# Altium project QUTMS-RAD-COMPILE-V00.PrjPcb
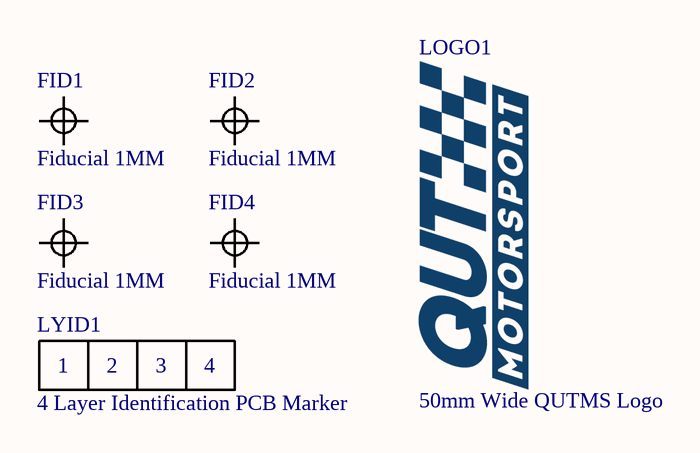
[diagram p0: RAD-Manufacturing-S00-V00.SchDoc]
1 sheet, 6 parts. Net scope: global (net labels, ports and power ports of the same name join across sheets).
Board file: RAD-B00-V00.PcbDoc

## Sheet RAD-Manufacturing-S00-V00.SchDoc: Manufacturing Items / Logos
size A4; Author: Jonn Dillon; DrawnBy: Jonn Dillon; SheetNumber: 1; SheetTotal: 1; Project: QUTMS-RADIO-COMPILE-V00

### Parts
FID1  Fiducial 1MM  [FIDUCIAL 1MM]  (no BOM)
FID2  Fiducial 1MM  [FIDUCIAL 1MM]  (no BOM)
FID3  Fiducial 1MM  [FIDUCIAL 1MM]  (no BOM)
FID4  Fiducial 1MM  [FIDUCIAL 1MM]  (no BOM)
LOGO1  50mm Wide QUTMS Logo  [QUTMS LOGO 50MM]  (no BOM)
LYID1  4 Layer Identification PCB Marker  [LAYER IDENT 4]  (no BOM)

### Notes on the sheet
- Revision History:
- Sheet Title:
- Rev
- Date
- Description
- Project:
- Size:
- Drawn By:
- A4
- Number:
- Revision:
- Sheet
- Version:
- of
- QUT Motorsport
- O-120, Gardens Point
- 2 George Street
- Brisbane, QLD 4000
- Australia
- Print Date:
- Print Time:
- File Name:
- (in symbol Layer Identification 4) 1; 2; 3; 4

### Library data of the parts
LOGO1 = QUTMS Logo 50mm
LYID1 = Layer Identification 4